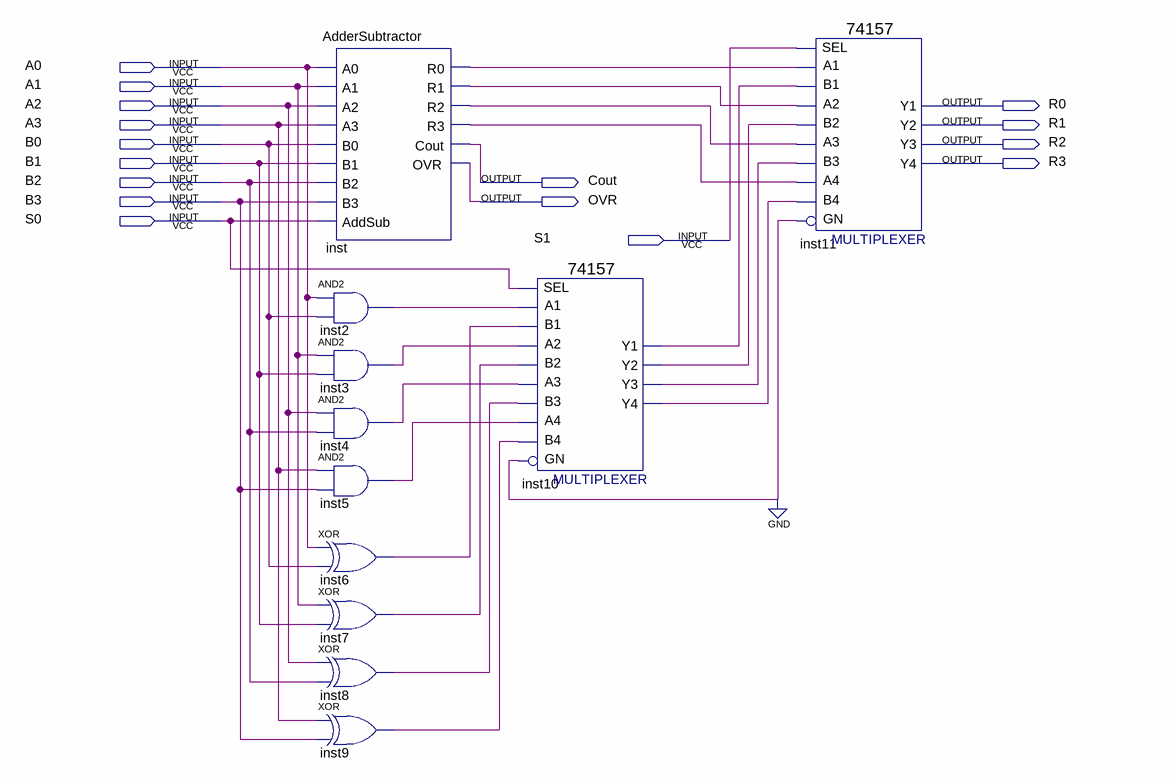
[diagram p0: schematic sheet]
// Quartus schematic 4BitALU.bdf as structural Verilog: 11 symbols, 16 pins
module \4BitALU  (
  input  A0,
  input  A1,
  input  A2,
  input  A3,
  input  B0,
  input  B1,
  input  B2,
  input  B3,
  input  S0,
  input  S1,
  output R0,
  output R1,
  output R2,
  output R3,
  output Cout,
  output OVR
);

  wire inst2_out, inst3_out, inst4_out, inst5_out, inst6_out, inst7_out, inst8_out, inst9_out, inst10_y1,
       inst10_y2, inst10_y3, inst10_y4, inst_r0, inst_r1, inst_r2, inst_r3;

  AdderSubtractor inst (
    .A0(A0), .A1(A1), .A2(A2), .A3(A3), .B0(B0), .B1(B1), .B2(B2), .B3(B3), .AddSub(S0), .R0(inst_r0),
    .R1(inst_r1), .R2(inst_r2), .R3(inst_r3), .Cout(Cout), .OVR(OVR));
  and inst2 (inst2_out, A0, B0);
  and inst3 (inst3_out, A1, B1);
  and inst4 (inst4_out, A2, B2);
  and inst5 (inst5_out, A3, B3);
  xor inst6 (inst6_out, A0, B0);
  xor inst7 (inst7_out, A1, B1);
  xor inst8 (inst8_out, A2, B2);
  xor inst9 (inst9_out, A3, B3);
  \74157  inst10 (
    .A1(inst2_out), .B1(inst6_out), .SEL(S0), .B2(inst7_out), .A3(inst4_out), .B3(inst8_out), .A2(inst3_out),
    .B4(inst9_out), .GN(1'b0), .A4(inst5_out), .Y2(inst10_y2), .Y1(inst10_y1), .Y4(inst10_y4), .Y3(inst10_y3));
  \74157  inst11 (
    .A1(inst_r0), .B1(inst10_y1), .SEL(S1), .B2(inst10_y2), .A3(inst_r2), .B3(inst10_y3), .A2(inst_r1),
    .B4(inst10_y4), .GN(1'b0), .A4(inst_r3), .Y2(R1), .Y1(R0), .Y4(R3), .Y3(R2));
endmodule
